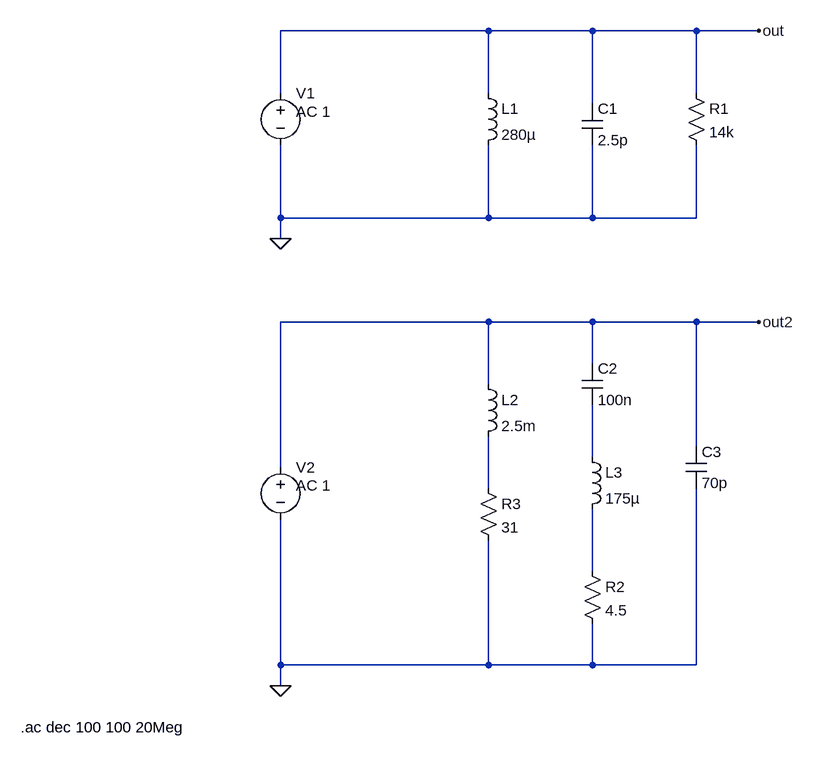
[diagram p0: schematic leakage_magnetizing_models.asc]
leakage_magnetizing_models.asc, the LTspice schematic file:
Version 4.1
SHEET 1 1432 784
WIRE 944 -304 624 -304
WIRE 1104 -304 944 -304
WIRE 1264 -304 1104 -304
WIRE 1360 -304 1264 -304
WIRE 624 -208 624 -304
WIRE 944 -208 944 -304
WIRE 1264 -208 1264 -304
WIRE 1104 -192 1104 -304
WIRE 624 -16 624 -128
WIRE 944 -16 944 -128
WIRE 944 -16 624 -16
WIRE 1104 -16 1104 -128
WIRE 1104 -16 944 -16
WIRE 1264 -16 1264 -128
WIRE 1264 -16 1104 -16
WIRE 624 16 624 -16
WIRE 944 144 624 144
WIRE 1104 144 944 144
WIRE 1264 144 1104 144
WIRE 1360 144 1264 144
WIRE 1104 208 1104 144
WIRE 944 240 944 144
WIRE 1264 336 1264 144
WIRE 1104 352 1104 272
WIRE 624 368 624 144
WIRE 944 400 944 320
WIRE 1104 528 1104 432
WIRE 624 672 624 448
WIRE 944 672 944 480
WIRE 944 672 624 672
WIRE 1104 672 1104 608
WIRE 1104 672 944 672
WIRE 1264 672 1264 400
WIRE 1264 672 1104 672
WIRE 624 704 624 672
FLAG 1360 -304 out
FLAG 624 16 0
FLAG 1360 144 out2
FLAG 624 704 0
SYMBOL voltage 624 -224 R0
WINDOW 123 24 44 Left 2
WINDOW 39 0 0 Left 0
SYMATTR InstName V1
SYMATTR Value ""
SYMATTR Value2 AC 1
SYMBOL ind 928 -224 R0
SYMATTR InstName L1
SYMATTR Value 280µ
SYMATTR SpiceLine Rser=1m
SYMBOL cap 1088 -192 R0
SYMATTR InstName C1
SYMATTR Value 2.5p
SYMBOL res 1248 -224 R0
SYMATTR InstName R1
SYMATTR Value 14k
SYMBOL voltage 624 352 R0
WINDOW 123 24 44 Left 2
WINDOW 39 0 0 Left 0
SYMATTR InstName V2
SYMATTR Value ""
SYMATTR Value2 AC 1
SYMBOL ind 928 224 R0
SYMATTR InstName L2
SYMATTR Value 2.5m
SYMATTR SpiceLine Rser=0
SYMBOL cap 1088 208 R0
SYMATTR InstName C2
SYMATTR Value 100n
SYMBOL res 928 384 R0
SYMATTR InstName R3
SYMATTR Value 31
SYMBOL ind 1088 336 R0
SYMATTR InstName L3
SYMATTR Value 175µ
SYMATTR SpiceLine Rser=0
SYMBOL res 1088 512 R0
SYMATTR InstName R2
SYMATTR Value 4.5
SYMBOL cap 1248 336 R0
SYMATTR InstName C3
SYMATTR Value 70p
SYMATTR SpiceLine Rser=600
TEXT 224 768 Left 2 !.ac dec 100 100 20Meg

The netlist it stands for:
* leakage_magnetizing_models.asc
V1 out 0 AC 1
L1 out 0 280µ Rser=1m
C1 out 0 2.5p
R1 out 0 14k
V2 out2 0 AC 1
L2 out2 N002 2.5m Rser=0
C2 out2 N001 100n
R3 N002 0 31
L3 N001 N003 175µ Rser=0
R2 N003 0 4.5
C3 out2 0 70p Rser=600
.ac dec 100 100 20Meg
.backanno
.end